# Altium schematic sheet main.SchDoc
size A; SheetNumber: 1; SheetTotal: 2
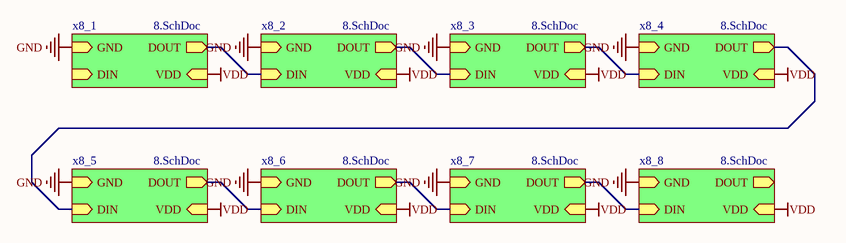
[diagram p0: main.SchDoc]

## Sub-sheets
x8_1 = 8.SchDoc: DIN (in), VDD, DOUT (out), GND
x8_2 = 8.SchDoc: DIN (in), VDD, DOUT (out), GND
x8_3 = 8.SchDoc: DIN (in), VDD, DOUT (out), GND
x8_4 = 8.SchDoc: DIN (in), VDD, DOUT (out), GND
x8_5 = 8.SchDoc: DIN (in), VDD, DOUT (out), GND
x8_6 = 8.SchDoc: DIN (in), VDD, DOUT (out), GND
x8_7 = 8.SchDoc: DIN (in), VDD, DOUT (out), GND
x8_8 = 8.SchDoc: DIN (in), VDD, DOUT (out), GND

## Nets
GND: sheet x8_1/GND, sheet x8_2/GND, sheet x8_3/GND, sheet x8_4/GND, sheet x8_5/GND, sheet x8_6/GND, sheet x8_7/GND, sheet x8_8/GND
VDD: sheet x8_1/VDD, sheet x8_2/VDD, sheet x8_3/VDD, sheet x8_4/VDD, sheet x8_5/VDD, sheet x8_6/VDD, sheet x8_7/VDD, sheet x8_8/VDD
(unnamed): sheet x8_1/DOUT, sheet x8_2/DIN
(unnamed): sheet x8_2/DOUT, sheet x8_3/DIN
(unnamed): sheet x8_3/DOUT, sheet x8_4/DIN
(unnamed): sheet x8_4/DOUT, sheet x8_5/DIN
(unnamed): sheet x8_5/DOUT, sheet x8_6/DIN
(unnamed): sheet x8_6/DOUT, sheet x8_7/DIN
(unnamed): sheet x8_7/DOUT, sheet x8_8/DIN